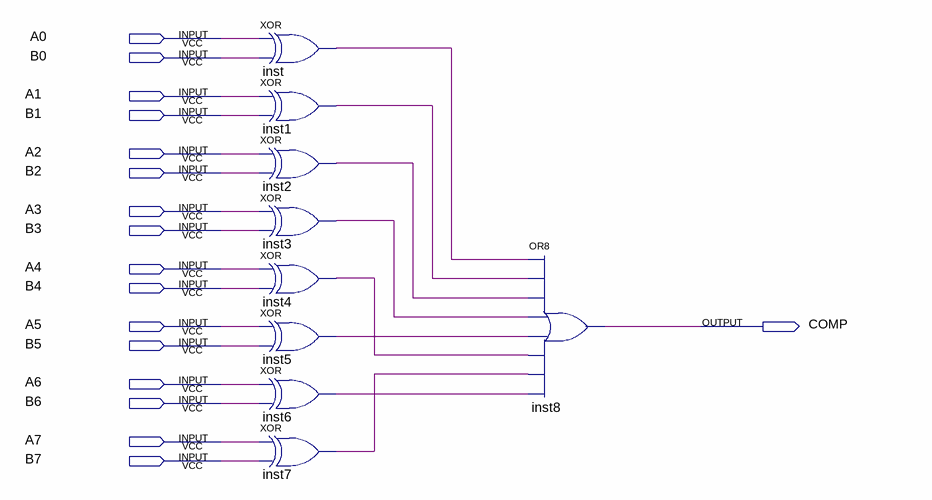
[diagram p0: schematic sheet]
// Quartus schematic Compare_8.bdf as structural Verilog: 9 symbols, 17 pins
module Compare_8 (
  input  A0,
  input  B0,
  input  A1,
  input  B1,
  input  A2,
  input  B2,
  input  A3,
  input  B3,
  input  A4,
  input  B4,
  input  A5,
  input  B5,
  input  A6,
  input  B6,
  input  A7,
  input  B7,
  output COMP
);

  wire inst1_out, inst2_out, inst3_out, inst4_out, inst5_out, inst6_out, inst7_out, inst_out;

  xor inst (inst_out, A0, B0);
  xor inst1 (inst1_out, A1, B1);
  xor inst2 (inst2_out, A2, B2);
  xor inst3 (inst3_out, A3, B3);
  xor inst4 (inst4_out, A4, B4);
  xor inst5 (inst5_out, A5, B5);
  xor inst6 (inst6_out, A6, B6);
  xor inst7 (inst7_out, A7, B7);
  or inst8 (COMP, inst_out, inst1_out, inst2_out, inst3_out, inst5_out, inst4_out, inst7_out, inst6_out);
endmodule
